# Altium project SMU_V2.03.PrjPcb
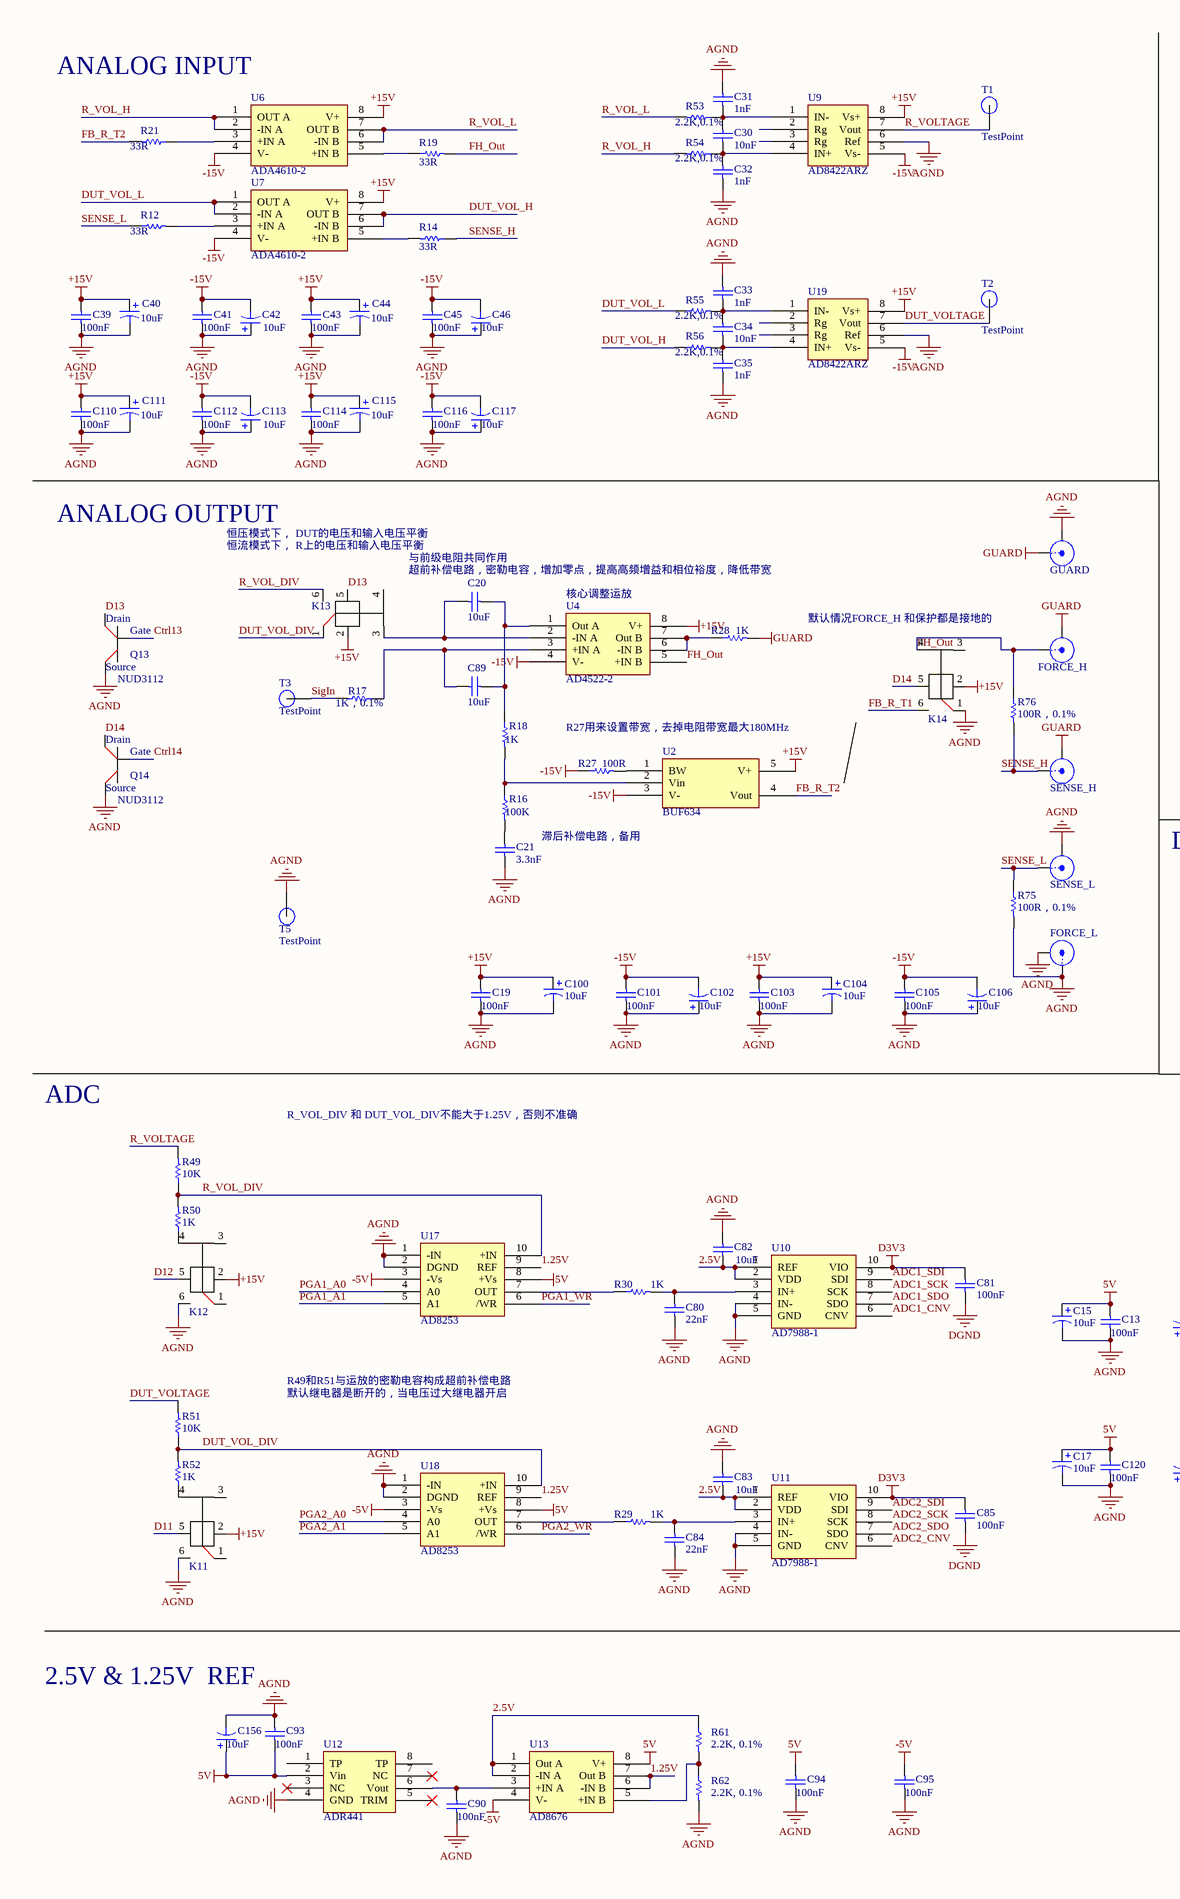
[diagram p0: Analog.SchDoc, left]
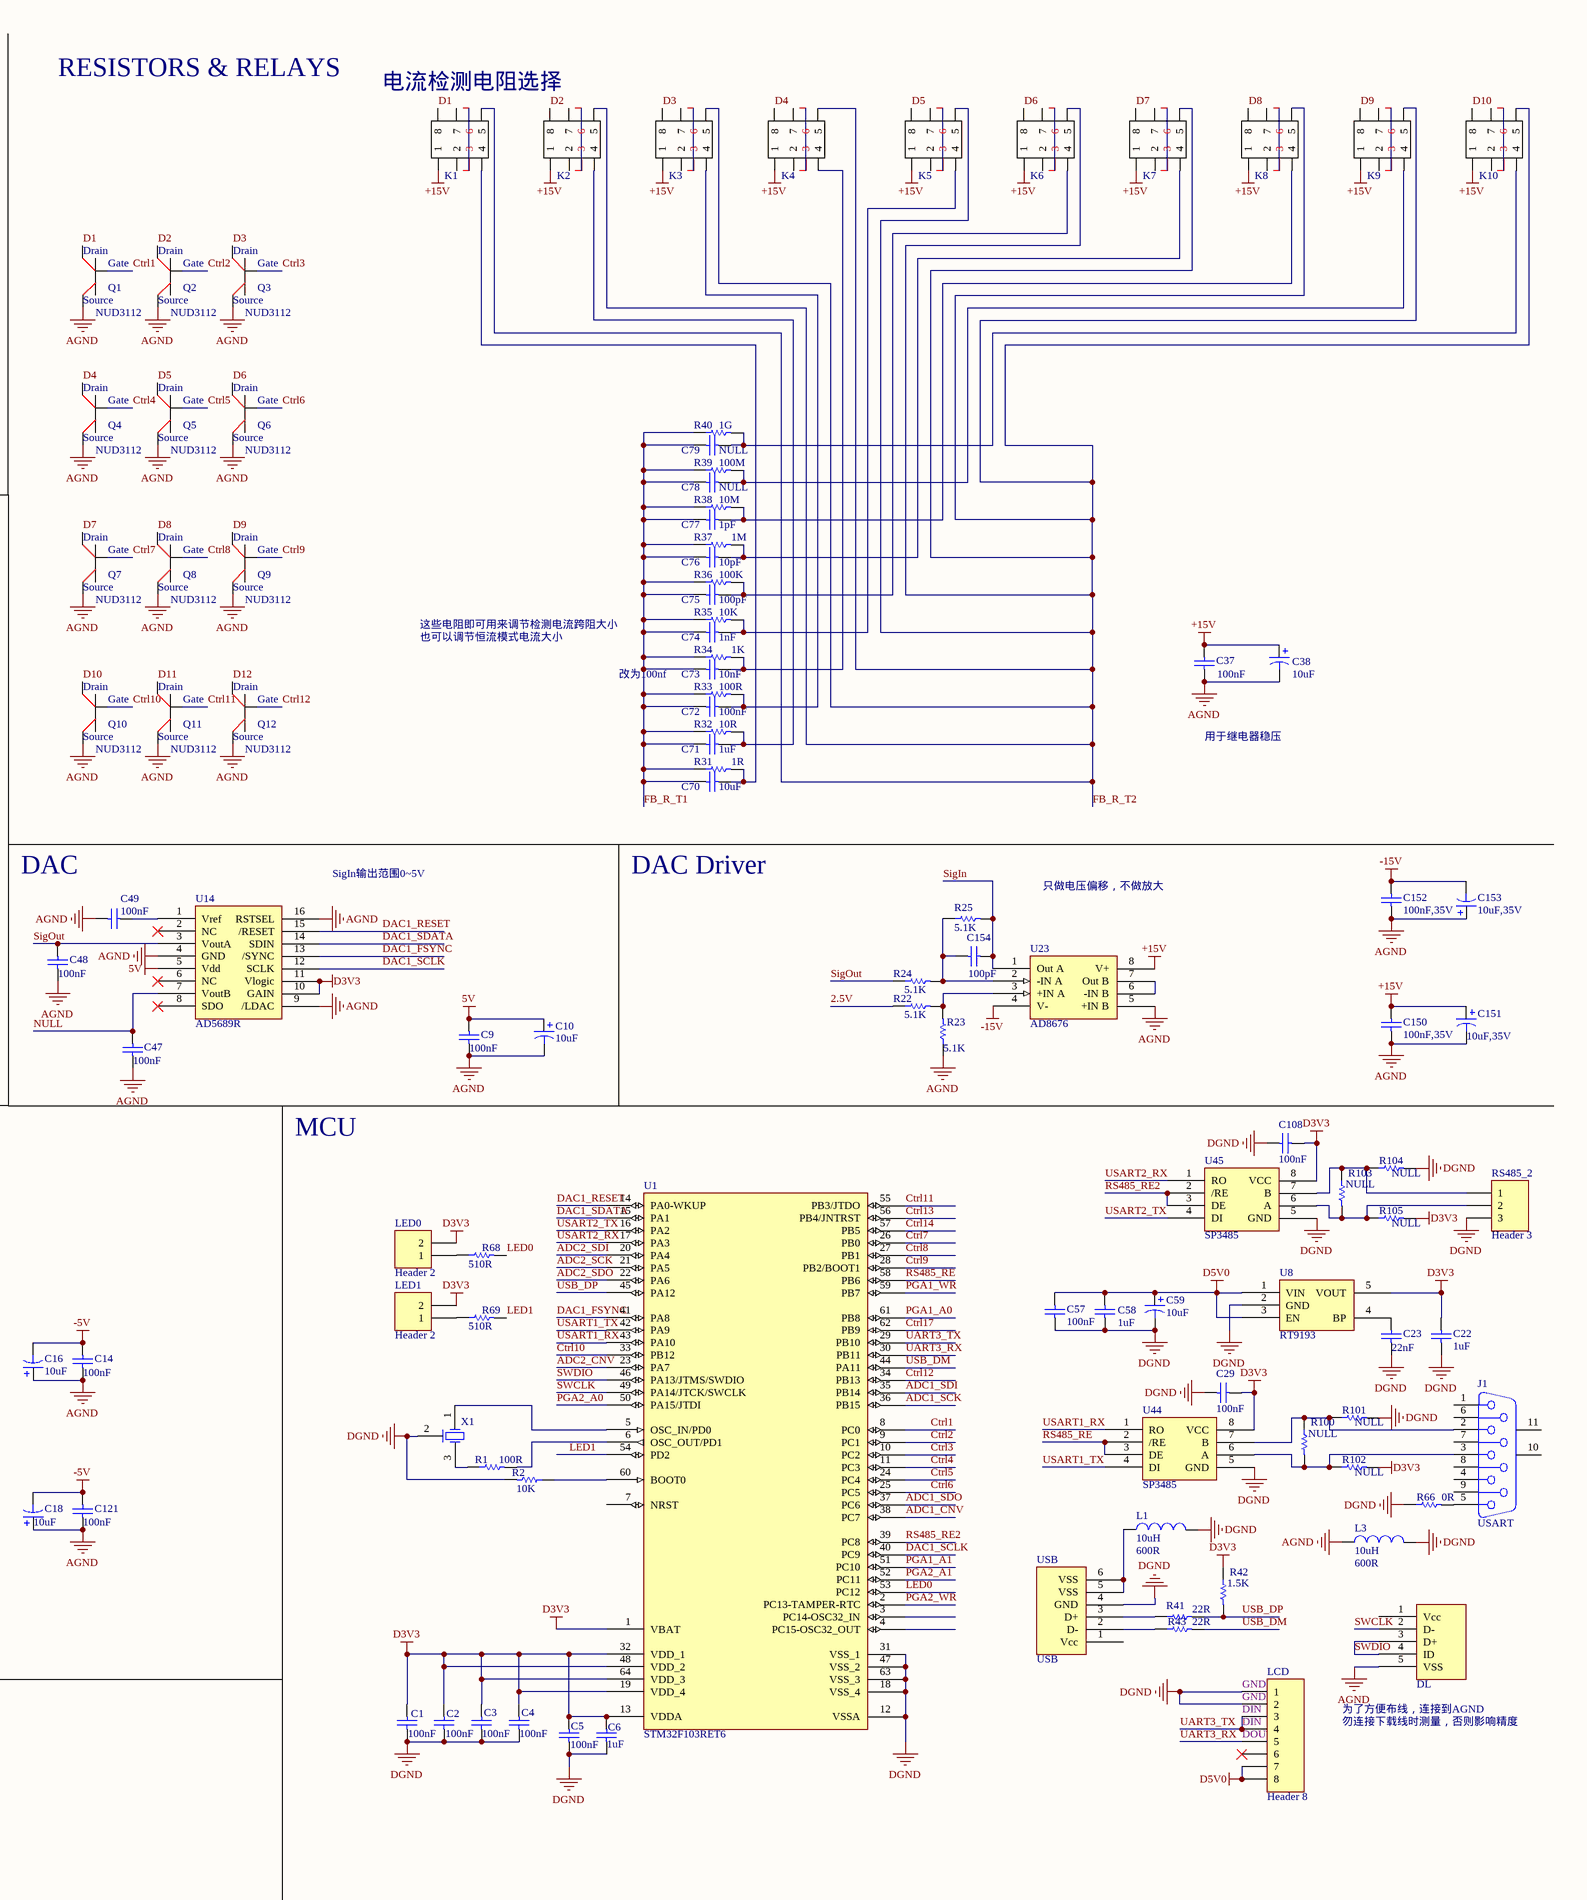
[diagram p1: Analog.SchDoc, right]
1 sheet, 203 parts. Net scope: global (net labels, ports and power ports of the same name join across sheets).
Board file: SMU_V2.03.PcbDoc

## Sheet Analog.SchDoc
size A2

### Parts
C1  100nF  [0603]
C2  100nF  [0603]
C3  100nF  [0603]
C4  100nF  [0603]
C5  100nF  [0603]
C6  1uF  [0603]
C9  100nF  [0603]
C10  10uF  [3216]
C13  100nF  [0603]
C14  100nF  [0603]
C15  10uF  [3216]
C16  10uF  [3216]
C17  10uF  [3216]
C18  10uF  [3216]
C19  100nF  [0603]
C20  10uF  [0805]
C21  3.3nF  [0603]
C22  1uF  [0603]
C23  22nF  [0603]
C29  100nF  [0603]
C30  10nF  [0603]
C31  1nF  [0603]
C32  1nF  [0603]
C33  1nF  [0603]
C34  10nF  [0603]
C35  1nF  [0603]
C37  100nF  [0603]
C38  10uF  [3216]
C39  100nF  [0603]
C40  10uF  [3216]
C41  100nF  [0603]
C42  10uF  [3216]
C43  100nF  [0603]
C44  10uF  [3216]
C45  100nF  [0603]
C46  10uF  [3216]
C47  100nF  [0603]
C48  100nF  [0603]
C49  100nF  [0603]
C57  100nF  [0805]
C58  1uF  [0805]
C59  10uF  [6032_pol]
C70  10uF  [0805]
C71  1uF  [0805]
C72  100nF  [0805]
C73  10nF  [0805]
C74  1nF  [0805]
C75  100pF  [0805]
C76  10pF  [0805]
C77  1pF  [0805]
C78  NULL  [0805]
C79  NULL  [0805]
C80  22nF  [0603]
C81  100nF  [0603]
C82  10uF  [0805]
C83  10uF  [0805]
C84  22nF  [0603]
C85  100nF  [0603]
C89  10uF  [0805]
C90  100nF  [0603]
C93  100nF  [0603]
C94  100nF  [0603]
C95  100nF  [0603]
C100  10uF  [3216]
C101  100nF  [0603]
C102  10uF  [3216]
C103  100nF  [0603]
C104  10uF  [3216]
C105  100nF  [0603]
C106  10uF  [3216]
C108  100nF  [0603]
C110  100nF  [0603]
C111  10uF  [3216]
C112  100nF  [0603]
C113  10uF  [3216]
C114  100nF  [0603]
C115  10uF  [3216]
C116  100nF  [0603]
C117  10uF  [3216]
C120  100nF  [0603]
C121  100nF  [0603]
C150  value 100nF,35V  [0603]  (hidden comment: 100nF)
C151  value 10uF,35V  [3216]  (hidden comment: 10uF)
C152  value 100nF,35V  [0603]  (hidden comment: 100nF)
C153  value 10uF,35V  [3216]  (hidden comment: 10uF)
C154  100pF  [0805]
C156  10uF  [3216]
DL  USB_5pin  [USBmicro_B]  (value not drawn)
FORCE_H  SMB  [SMA]  (value not drawn)
FORCE_L  SMB  [SMA]  (value not drawn)
GUARD  SMB  [SMA]  (value not drawn)
J1  USART  [DSUB1.385-2H9]
K1  AXICOM IM  [AXICOM_IM06]  (value not drawn)
K2  AXICOM IM  [AXICOM_IM06]  (value not drawn)
K3  AXICOM IM  [AXICOM_IM06]  (value not drawn)
K4  AXICOM IM  [AXICOM_IM06]  (value not drawn)
K5  AXICOM IM  [AXICOM_IM06]  (value not drawn)
K6  AXICOM IM  [AXICOM_IM06]  (value not drawn)
K7  AXICOM IM  [AXICOM_IM06]  (value not drawn)
K8  AXICOM IM  [AXICOM_IM06]  (value not drawn)
K9  AXICOM IM  [AXICOM_IM06]  (value not drawn)
K10  AXICOM IM  [AXICOM_IM06]  (value not drawn)
K11  Relay  [Relay_OMRON5V]  (value not drawn)
K12  Relay  [Relay_OMRON5V]  (value not drawn)
K13  Relay  [Relay_OMRON5V]  (value not drawn)
K14  Relay  [Relay_OMRON5V]  (value not drawn)
L1  10uH  value 600R  [0805]
L3  10uH  value 600R  [1206]
LCD  Header 8  [HDR1X8]
LED0  Header 2  [HDR1X2]
LED1  Header 2  [HDR1X2]
Q1  NUD3112  [SOT23]
Q2  NUD3112  [SOT23]
Q3  NUD3112  [SOT23]
Q4  NUD3112  [SOT23]
Q5  NUD3112  [SOT23]
Q6  NUD3112  [SOT23]
Q7  NUD3112  [SOT23]
Q8  NUD3112  [SOT23]
Q9  NUD3112  [SOT23]
Q10  NUD3112  [SOT23]
Q11  NUD3112  [SOT23]
Q12  NUD3112  [SOT23]
Q13  NUD3112  [SOT23]
Q14  NUD3112  [SOT23]
R1  100R  [0603]
R2  10K  [0603]
R12  33R  [0603]
R14  33R  [0603]
R16  100K  [0603]
R17  1K，0.1%  [0603]
R18  1K  [0603]
R19  33R  [0603]
R21  33R  [0603]
R22  5.1K  [0805]
R23  5.1K  [0805]
R24  5.1K  [0805]
R25  5.1K  [0805]
R27  100R  [0603]
R28  1K  [0603]
R29  1K  [0603]
R30  1K  [0603]
R31  1R  [0805]
R32  10R  [0805]
R33  100R  [0805]
R34  1K  [0805]
R35  10K  [0805]
R36  100K  [0805]
R37  1M  [0805]
R38  10M  [0805]
R39  100M  [0805]
R40  1G  [0805]
R41  22R  [0402]
R42  1.5K  [0402]
R43  22R  [0402]
R49  10K  [0603]
R50  1K  [0603]
R51  10K  [0603]
R52  1K  [0603]
R53  2.2K,0.1%  [0603]
R54  2.2K,0.1%  [0603]
R55  2.2K,0.1%  [0603]
R56  2.2K,0.1%  [0603]
R61  2.2K, 0.1%  [0603]
R62  2.2K, 0.1%  [0603]
R66  0R  [0402]
R68  510R  [0603]
R69  510R  [0603]
R75  100R，0.1%  [0603]
R76  100R，0.1%  [0603]
R100  NULL  [0603]
R101  NULL  [0603]
R102  NULL  [0603]
R103  NULL  [0603]
R104  NULL  [0603]
R105  NULL  [0603]
RS485_2  Header 3  [HDR1X3]
SENSE_H  SMB  [SMA]  (value not drawn)
SENSE_L  SMB  [SMA]  (value not drawn)
T1  TestPoint  [TestPoint]
T2  TestPoint  [TestPoint]
T3  TestPoint  [TestPoint]
T5  TestPoint  [TestPoint]
U1  STM32F103RET6  [LQFP64_N]
U2  BUF634  [PSFM-T5]
U4  AD4522-2  [SO-8N]
U6  ADA4610-2  [MSO-8]
U7  ADA4610-2  [MSO-8]
U8  RT9193  [SOT-23-5]
U9  AD8422ARZ  [SO-8N]
U10  AD7988-1  [MSOP10]
U11  AD7988-1  [MSOP10]
U12  ADR441  [SO-8N]
U13  AD8676  [SO-8N]
U14  AD5689R  [TSSOP16]
U17  AD8253  [RM-10]
U18  AD8253  [RM-10]
U19  AD8422ARZ  [SO-8N]
U23  AD8676  [SO-8N]
U44  SP3485  [SO-8N]
U45  SP3485  [SO-8N]
USB  USB  [USB_A]
X1  8M smd  [8Mhz_XTAL]  (value not drawn)

### Nets
5V: C9.2 C10.1 C13.2 C15.1 C17.1 C93.1 C94.2 C120.2 C156.1 U12.2(Vin) U13.8(V+) U14.5(Vdd) U17.8(+Vs) U18.8(+Vs)
+15V: C19.2 C37.2 C38.1 C39.2 C40.1 C43.2 C44.1 C100.1 C103.2 C104.1 C110.2 C111.1 C114.2 C115.1 C150.2 C151.1 K1.1 K2.1 K3.1 K4.1 K5.1 K6.1 K7.1 K8.1 K9.1 K10.1 K11.2 K12.2 K13.2 K14.2 U2.5(V+) U4.8(V+) U6.8(V+) U7.8(V+) U9.8(Vs+) U19.8(Vs+) U23.8(V+)
-5V: C14.2 C16.2 C18.2 C95.2 C121.2 U13.4(V-) U17.3(-Vs) U18.3(-Vs)
-15V: C41.2 C42.2 C45.2 C46.2 C101.2 C102.2 C105.2 C106.2 C112.2 C113.2 C116.2 C117.2 C152.2 C153.2 R27.1 U2.3(V-) U4.4(V-) U6.4(V-) U7.4(V-) U9.5(Vs-) U19.5(Vs-) U23.4(V-)
AGND: C9.1 C10.2 C13.1 C14.1 C15.2 C16.1 C17.2 C18.1 C19.1 C21.2 C31.1 C32.2 C33.1 C35.2 C37.1 C38.2 C39.1 C40.2 C41.1 C42.1 C43.1 C44.2 C45.1 C46.1 C47.2 C48.2 C49.2 C80.2 C82.2 C83.2 C84.1 C90.1 C93.2 C94.1 C95.1 C100.2 C101.1 C102.1 C103.1 C104.2 C105.1 C106.1 C110.1 C111.2 C112.1 C113.1 C114.1 C115.2 C116.1 C117.1 C120.1 C121.1 C150.1 C151.2 C152.1 C153.1 C156.2 DL.5(VSS) FORCE_L.1(X) FORCE_L.2(Y) GUARD.2(Y) K11.6 K12.6 K14.1 L3.1 Q1.2(Source) Q2.2(Source) Q3.2(Source) Q4.2(Source) Q5.2(Source) Q6.2(Source) Q7.2(Source) Q8.2(Source) Q9.2(Source) Q10.2(Source) Q11.2(Source) Q12.2(Source) Q13.2(Source) Q14.2(Source) R23.1 R62.2 R75.2 SENSE_L.2(Y) T5.1 U9.6(Ref) U10.4(IN-) U10.5(GND) U11.4(IN-) U11.5(GND) U12.4(GND) U14.4(GND) U14.9(/LDAC) U14.16(RSTSEL) U17.1(-IN) U17.2(DGND) U18.1(-IN) U18.2(DGND) U19.6(Ref) U23.5(+IN_B)
D3V3: C1.2 C2.2 C3.2 C4.2 C5.2 C6.2 C22.2 C29.2 C81.2 C85.2 C108.2 LED0.2 LED1.2 R42.1 R102.2 R105.2 U1.1(VBAT) U1.13(VDDA) U1.19(VDD_4) U1.32(VDD_1) U1.48(VDD_2) U1.64(VDD_3) U8.5(VOUT) U10.10(VIO) U11.10(VIO) U14.10(GAIN) U14.11(Vlogic) U44.8(VCC) U45.8(VCC)
D5V0: C57.2 C58.2 C59.1 LCD.7 LCD.8 U8.1(VIN) U8.3(EN)
DGND: C1.1 C2.1 C3.1 C4.1 C5.1 C6.1 C22.1 C23.1 C29.1 C57.1 C58.1 C59.2 C81.1 C85.1 C108.1 L1.2 L3.2 LCD.1 LCD.2 R2.2 R66.1 R101.2 R104.2 RS485_2.3 U1.12(VSSA) U1.18(VSS_4) U1.31(VSS_1) U1.47(VSS_2) U1.63(VSS_3) U8.2(GND) U44.5(GND) U45.5(GND) USB.4(GND) X1.2(GND)
GUARD: FORCE_H.2(Y) GUARD.1(X) R28.2 SENSE_H.2(Y)
1.25V: U13.6(-IN_B) U13.7(Out_B) U17.9(REF) U18.9(REF)
2.5V: C82.1 C83.1 R22.1 R61.1 U10.1(REF) U10.2(VDD) U11.1(REF) U11.2(VDD) U13.1(Out_A) U13.2(-IN_A)
ADC1_CNV: U1.38(PC7) U10.6(CNV)
ADC1_SCK: U1.36(PB15) U10.8(SCK)
ADC1_SDI: U1.35(PB14) U10.9(SDI)
ADC1_SDO: U1.37(PC6) U10.7(SDO)
ADC2_CNV: U1.23(PA7) U11.6(CNV)
ADC2_SCK: U1.21(PA5) U11.8(SCK)
ADC2_SDI: U1.20(PA4) U11.9(SDI)
ADC2_SDO: U1.22(PA6) U11.7(SDO)
Ctrl1: Q1.1(Gate) U1.8(PC0)
Ctrl2: Q2.1(Gate) U1.9(PC1)
Ctrl3: Q3.1(Gate) U1.10(PC2)
Ctrl4: Q4.1(Gate) U1.11(PC3)
Ctrl5: Q5.1(Gate) U1.24(PC4)
Ctrl6: Q6.1(Gate) U1.25(PC5)
Ctrl7: Q7.1(Gate) U1.26(PB0)
Ctrl8: Q8.1(Gate) U1.27(PB1)
Ctrl9: Q9.1(Gate) U1.28(PB2/BOOT1)
Ctrl10: Q10.1(Gate) U1.33(PB12)
Ctrl11: Q11.1(Gate) U1.55(PB3/JTDO)
Ctrl12: Q12.1(Gate) U1.34(PB13)
Ctrl13: Q13.1(Gate) U1.56(PB4/JNTRST)
Ctrl14: Q14.1(Gate) U1.57(PB5)
Ctrl17: U1.62(PB9)
D1: K1.8 Q1.3(Drain)
D2: K2.8 Q2.3(Drain)
D3: K3.8 Q3.3(Drain)
D4: K4.8 Q4.3(Drain)
D5: K5.8 Q5.3(Drain)
D6: K6.8 Q6.3(Drain)
D7: K7.8 Q7.3(Drain)
D8: K8.8 Q8.3(Drain)
D9: K9.8 Q9.3(Drain)
D10: K10.8 Q10.3(Drain)
D11: K11.5 Q11.3(Drain)
D12: K12.5 Q12.3(Drain)
D13: K13.5 Q13.3(Drain)
D14: K14.5 Q14.3(Drain)
DAC1_FSYNC: U1.41(PA8) U14.13(/SYNC)
DAC1_RESET: U1.14(PA0-WKUP) U14.15(/RESET)
DAC1_SCLK: U1.40(PC9) U14.12(SCLK)
DAC1_SDATA: U1.15(PA1) U14.14(SDIN)
DUT_VOL_DIV: K13.1 R51.1 R52.2 U18.10(+IN)
DUT_VOL_H: R56.1 U7.6(-IN_B) U7.7(OUT_B)
DUT_VOL_L: R55.1 U7.1(OUT_A) U7.2(-IN_A)
DUT_VOLTAGE: R51.2 T2.1 U19.7(Vout)
FB_R_T1: C70.1 C71.1 C72.1 C73.1 C74.1 C75.1 C76.1 C77.1 C78.1 C79.1 K14.6 R31.1 R32.1 R33.1 R34.1 R35.1 R36.1 R37.1 R38.1 R39.1 R40.1
FB_R_T2: K1.5 K2.5 K3.5 K4.5 K5.5 K6.5 K7.5 K8.5 K9.5 K10.5 R21.2 U2.4(Vout)
FH_Out: FORCE_H.1(X) K14.4 R19.2 R76.1 U4.5(+IN_B)
LED0: R68.2 U1.53(PC12)
LED1: R69.2 U1.54(PD2)
NULL: C47.1 U14.7(VoutB)
PGA1_A0: U1.61(PB8) U17.4(A0)
PGA1_A1: U1.51(PC10) U17.5(A1)
PGA1_WR: U1.59(PB7) U17.6(/WR)
PGA2_A0: U1.50(PA15/JTDI) U18.4(A0)
PGA2_A1: U1.52(PC11) U18.5(A1)
PGA2_WR: U1.2(PC13-TAMPER-RTC) U18.6(/WR)
R_VOL_DIV: K13.6 R49.1 R50.2 U17.10(+IN)
R_VOL_H: R54.2 U6.1(OUT_A) U6.2(-IN_A)
R_VOL_L: R53.2 U6.6(-IN_B) U6.7(OUT_B)
R_VOLTAGE: R49.2 T1.1 U9.7(Vout)
RS485_RE: U1.58(PB6) U44.2(/RE) U44.3(DE)
RS485_RE2: U1.39(PC8) U45.2(/RE) U45.3(DE)
SENSE_H: R14.1 R76.2 SENSE_H.1(X)
SENSE_L: R12.1 R75.1 SENSE_L.1(X)
SigIn: C154.2 R17.2 R25.2 T3.1 U23.1(Out_A)
SigOut: C48.1 R24.1 U14.3(VoutA)
SWCLK: DL.2(D-) U1.49(PA14/JTCK/SWCLK)
SWDIO: DL.3(D+) DL.4(ID) U1.46(PA13/JTMS/SWDIO)
UART3_RX: LCD.5 U1.30(PB11)
UART3_TX: LCD.3 LCD.4 U1.29(PB10)
USART1_RX: U1.43(PA10) U44.1(RO)
USART1_TX: U1.42(PA9) U44.4(DI)
USART2_RX: U1.17(PA3) U45.1(RO)
USART2_TX: U1.16(PA2) U45.4(DI)
USB_DM: R43.2 U1.44(PA11)
USB_DP: R41.2 R42.2 U1.45(PA12)
NetC20_1: C20.1 K13.3 U4.2(-IN_A)
NetC20_2: C20.2 C89.2 R18.1 U4.1(Out_A)
NetC21_1: C21.1 R16.2
NetC23_2: C23.2 U8.4(BP)
NetC30_1: C30.1 C31.2 R53.1 U9.1(IN-)
NetC30_2: C30.2 C32.1 R54.1 U9.4(IN+)
NetC33_2: C33.2 C34.1 R55.2 U19.1(IN-)
NetC34_2: C34.2 C35.1 R56.2 U19.4(IN+)
NetC49_1: C49.1 U14.1(Vref)
NetC70_2: C70.2 K1.4 R31.2
NetC71_2: C71.2 K2.4 R32.2
NetC72_2: C72.2 K3.4 R33.2
NetC73_2: C73.2 K4.4 R34.2
NetC74_2: C74.2 K5.4 R35.2
NetC75_2: C75.2 K6.4 R36.2
NetC76_2: C76.2 K7.4 R37.2
NetC77_2: C77.2 K8.4 R38.2
NetC78_2: C78.2 K9.4 R39.2
NetC79_2: C79.2 K10.4 R40.2
NetC80_1: C80.1 R30.2 U10.3(IN+)
NetC84_2: C84.2 R29.2 U11.3(IN+)
NetC89_1: C89.1 R17.1 U4.3(+IN_A)
NetC90_2: C90.2 U12.6(Vout) U13.3(+IN_A)
NetC154_1: C154.1 R24.2 R25.1 U23.2(-IN_A)
NetJ1_2: J1.2 R100.1 R101.1 U44.7(B)
NetJ1_3: J1.3 R100.2 R102.1 U44.6(A)
NetJ1_5: J1.5 R66.2
NetK1_3: K1.3 K1.6
NetK2_3: K2.3 K2.6
NetK3_3: K3.3 K3.6
NetK4_3: K4.3 K4.6
NetK5_3: K5.3 K5.6
NetK6_3: K6.3 K6.6
NetK7_3: K7.3 K7.6
NetK8_3: K8.3 K8.6
NetK9_3: K9.3 K9.6
NetK10_3: K10.3 K10.6
NetK11_4: K11.4 R52.1
NetK12_4: K12.4 R50.1
NetL1_1: L1.1 USB.5(VSS) USB.6(VSS)
NetLED0_1: LED0.1 R68.1
NetLED1_1: LED1.1 R69.1
NetR1_1: R1.1 X1.3(OSC2)
NetR1_2: R1.2 U1.6(OSC_OUT/PD1)
NetR2_1: R2.1 U1.60(BOOT0)
NetR12_2: R12.2 U7.3(+IN_A)
NetR14_2: R14.2 U7.5(+IN_B)
NetR16_1: R16.1 R18.2 U2.2(Vin)
NetR19_1: R19.1 U6.5(+IN_B)
NetR21_1: R21.1 U6.3(+IN_A)
NetR22_2: R22.2 R23.2 U23.3(+IN_A)
NetR27_2: R27.2 U2.1(BW)
NetR28_1: R28.1 U4.6(-IN_B) U4.7(Out_B)
NetR29_1: R29.1 U18.7(OUT)
NetR30_1: R30.1 U17.7(OUT)
NetR41_1: R41.1 USB.3(D+)
NetR43_1: R43.1 USB.2(D-)
NetR61_2: R61.2 R62.1 U13.5(+IN_B)
NetR103_1: R103.1 R104.1 RS485_2.1 U45.7(B)
NetR103_2: R103.2 R105.1 RS485_2.2 U45.6(A)
NetU1_5: U1.5(OSC_IN/PD0) X1.1(OSC1)
NetU23_6: U23.6(-IN_B) U23.7(Out_B)

Not connected (* = marked no-connect by the designer): DL 1(Vcc); J1 1 4 6 7 8 9 10(MH1) 11(MH2); K1 2 7; K2 2 7; K3 2 7; K4 2 7; K5 2 7; K6 2 7; K7 2 7; K8 2 7; K9 2 7; K10 2 7; K11 1 3; K12 1 3; K13 4; K14 3; LCD 6*; U1 3(PC14-OSC32_IN) 4(PC15-OSC32_OUT) 7(NRST); U9 2(Rg) 3(Rg); U12 1(TP) 3(NC)* 5(TRIM)* 7(NC)* 8(TP); U14 2(NC)* 6(NC)* 8(SDO)*; U19 2(Rg) 3(Rg); USB 1(Vcc)

### Notes on the sheet
- ANALOG INPUT
- RESISTORS & RELAYS
- (near K1) 电流检测电阻选择
- ANALOG OUTPUT
- 恒压模式下， DUT的电压和输入电压平衡
- 恒流模式下， R上的电压和输入电压平衡
- 超前补偿电路，密勒电容，增加零点，提高高频增益和相位裕度，降低带宽
- 与前级电阻共同作用
- (near U4) 核心调整运放
- (near K14) 默认情况FORCE_H 和保护都是接地的
- 这些电阻即可用来调节检测电流跨阻大小
- 也可以调节恒流模式电流大小
- 改为100nf
- R27用来设置带宽，去掉电阻带宽最大180MHz
- 用于继电器稳压
- 滞后补偿电路，备用
- DAC
- SigIn输出范围0~5V
- DAC Driver
- 只做电压偏移，不做放大
- ADC
- R_VOL_DIV 和 DUT_VOL_DIV不能大于1.25V，否则不准确
- MCU
- R49和R51与运放的密勒电容构成超前补偿电路
- 默认继电器是断开的，当电压过大继电器开启
- (near LCD) DIN
- (near LCD) GND
- (near DL) 为了方便布线，连接到AGND
- 勿连接下载线时测量，否则影响精度
- 2.5V & 1.25V  REF
- (near LCD) DOUT

### Library data of the parts
C1-C6 C13 C14 C22 C23 C29-C35 C47-C49 C58 C78-C80 C82-C84 C90 C93-C95 C108 C120 C121 C150 C152 C154 = Cap: Capacitor; Published: 8-Jun-2000; LatestRevisionDate: 17-Jul-2002; LatestRevisionNote: Re-released for DXP Platform.; PackageReference: RAD-0.3; Publisher: Altium Limited; PackageDescription: Radial Cap, Thru-Hole; 2 Leads; 0.3 in Pin Spacing
  C1-C5 C13 C14 C29 C47-C49 C90 C93-C95 C108 C120 C121: Value: 100nF
  C6: Value: 1uf
  C22 C58: Value: 1uF
  C23 C80 C84: Value: 22nF
  C30 C34: Value: 10nF
  C31-C33 C35: Value: 1nF
  C78 C79: Value: NULL
  C82 C83: Value: 10uF
  C154: Value: 100pF
C9 C19 C37 C39 C41 C43 C45 C72 C101 C103 C105 C110 C112 C114 C116 = Cap: Capacitor; Value: 100nF,35V; Published: 8-Jun-2000; LatestRevisionDate: 17-Jul-2002; LatestRevisionNote: Re-released for DXP Platform.; PackageReference: RAD-0.3; Publisher: Altium Limited; PackageDescription: Radial Cap, Thru-Hole; 2 Leads; 0.3 in Pin Spacing
C10 C15-C18 C38 C40 C42 C44 C46 C100 C102 C104 C106 C111 C113 C115 C117 C156 = Cap Pol1: Polarized Capacitor (Radial); Value: 10uF,35V; Published: 8-Jun-2000; LatestRevisionDate: 17-Jul-2002; LatestRevisionNote: Re-released for DXP Platform.; PackageReference: RB7.6-15; Publisher: Altium Limited; PackageDescription: Polarized Capacitor (Radial); 2 Leads
C20 C21 C89 = Cap: Capacitor; Value: 3.3nF,35V; Published: 8-Jun-2000; LatestRevisionDate: 17-Jul-2002; LatestRevisionNote: Re-released for DXP Platform.; PackageReference: RAD-0.3; Publisher: Altium Limited; PackageDescription: Radial Cap, Thru-Hole; 2 Leads; 0.3 in Pin Spacing
C57 C81 C85 = Cap: Capacitor,100V; Published: 8-Jun-2000; LatestRevisionDate: 17-Jul-2002; LatestRevisionNote: Re-released for DXP Platform.; PackageReference: RAD-0.3; Publisher: Altium Limited; PackageDescription: Radial Cap, Thru-Hole; 2 Leads; 0.3 in Pin Spacing; Value: 100nF
C59 C151 C153 = Cap Pol1: Polarized Capacitor (Radial); Published: 8-Jun-2000; LatestRevisionDate: 17-Jul-2002; LatestRevisionNote: Re-released for DXP Platform.; PackageReference: RB7.6-15; Publisher: Altium Limited; PackageDescription: Polarized Capacitor (Radial); 2 Leads
  C59: Value: 10uF
C70 = Cap: Capacitor; Value: 10uF,35V; Published: 8-Jun-2000; LatestRevisionDate: 17-Jul-2002; LatestRevisionNote: Re-released for DXP Platform.; PackageReference: RAD-0.3; Publisher: Altium Limited; PackageDescription: Radial Cap, Thru-Hole; 2 Leads; 0.3 in Pin Spacing
C71 = Cap: Capacitor; Value: 1uF,35V; Published: 8-Jun-2000; LatestRevisionDate: 17-Jul-2002; LatestRevisionNote: Re-released for DXP Platform.; PackageReference: RAD-0.3; Publisher: Altium Limited; PackageDescription: Radial Cap, Thru-Hole; 2 Leads; 0.3 in Pin Spacing
C73 = Cap: Capacitor; Value: 10nF,35V; Published: 8-Jun-2000; LatestRevisionDate: 17-Jul-2002; LatestRevisionNote: Re-released for DXP Platform.; PackageReference: RAD-0.3; Publisher: Altium Limited; PackageDescription: Radial Cap, Thru-Hole; 2 Leads; 0.3 in Pin Spacing
C74 = Cap: Capacitor; Value: 1nF,35V; Published: 8-Jun-2000; LatestRevisionDate: 17-Jul-2002; LatestRevisionNote: Re-released for DXP Platform.; PackageReference: RAD-0.3; Publisher: Altium Limited; PackageDescription: Radial Cap, Thru-Hole; 2 Leads; 0.3 in Pin Spacing
C75 = Cap: Capacitor; Value: 100pF,35V; Published: 8-Jun-2000; LatestRevisionDate: 17-Jul-2002; LatestRevisionNote: Re-released for DXP Platform.; PackageReference: RAD-0.3; Publisher: Altium Limited; PackageDescription: Radial Cap, Thru-Hole; 2 Leads; 0.3 in Pin Spacing
C76 = Cap: Capacitor; Value: 10pF,35V; Published: 8-Jun-2000; LatestRevisionDate: 17-Jul-2002; LatestRevisionNote: Re-released for DXP Platform.; PackageReference: RAD-0.3; Publisher: Altium Limited; PackageDescription: Radial Cap, Thru-Hole; 2 Leads; 0.3 in Pin Spacing
C77 = Cap: Capacitor; Value: 1pF,35V; Published: 8-Jun-2000; LatestRevisionDate: 17-Jul-2002; LatestRevisionNote: Re-released for DXP Platform.; PackageReference: RAD-0.3; Publisher: Altium Limited; PackageDescription: Radial Cap, Thru-Hole; 2 Leads; 0.3 in Pin Spacing
FORCE_H FORCE_L GUARD SENSE_H SENSE_L = SMB: SMB Straight Connector; LatestRevisionDate: 17-Jul-2002; LatestRevisionNote: Re-released for DXP Platform.; Publisher: Altium Limited
J1 = D Connector 9: Receptacle Assembly, 9 Position, Right Angle; PackageDocument: O; Positions: 9; Published: 15-Jun-2001; LatestRevisionDate: 17-Jul-2002; LatestRevisionNote: Re-released for DXP Platform.; DatasheetDocument: 1-Sep-1999; PackageReference: 788750; Publisher: Altium Limited; Orientation: Right Angle; Gender: Receptacle
K1-K10 = AXiCOM IM05
K11-K14 = Relay_OMRON5V: Relay OMRON
L1 L3 = Inductor: Code_IEC: 1005; Published: 8-Jun-2000; LatestRevisionDate: 29-May-2009; LatestRevisionNote: IPC-7351 Footprint Added.; PackageReference: 0402-A; Publisher: Altium Limited; PackageDescription: Chip Inductor; Code_JEITA: 0402
LCD = Header 8: Header, 8-Pin; LatestRevisionDate: 17-Jul-2002; LatestRevisionNote: Re-released for DXP Platform.; Publisher: Altium Limited
LED0 LED1 = Header 2: Header, 2-Pin; LatestRevisionDate: 17-Jul-2002; LatestRevisionNote: Re-released for DXP Platform.; Publisher: Altium Limited
Q1-Q14 = NUD3105: Relay Driver 5V Supply; manufactor: On Semiconductor
R1 R2 R16 R22 R24 R27-R43 R50 R52 R53 R66 R100-R105 = Res1: Resistor; Published: 8-Jun-2000; LatestRevisionDate: 17-Jul-2002; LatestRevisionNote: Re-released for DXP Platform.; PackageReference: AXIAL-0.3; Publisher: Altium Limited
  R1 R27 R33: PackageDescription: Axial Device, Thru-Hole; 2 Leads; 0.3 in Pin Spacing; Value: 100R
  R2: Value: 10K
  R16 R36: PackageDescription: Axial Device, Thru-Hole; 2 Leads; 0.3 in Pin Spacing; Value: 100K
  R22 R24: PackageDescription: Axial Device, Thru-Hole; 2 Leads; 0.3 in Pin Spacing; Value: 5.1K
  R28-R30 R34 R50 R52: PackageDescription: Axial Device, Thru-Hole; 2 Leads; 0.3 in Pin Spacing; Value: 1K
  R31: PackageDescription: Axial Device, Thru-Hole; 2 Leads; 0.3 in Pin Spacing; Value: 1R
  R32: PackageDescription: Axial Device, Thru-Hole; 2 Leads; 0.3 in Pin Spacing; Value: 10R
  R35: PackageDescription: Axial Device, Thru-Hole; 2 Leads; 0.3 in Pin Spacing; Value: 10K
  R37: PackageDescription: Axial Device, Thru-Hole; 2 Leads; 0.3 in Pin Spacing; Value: 1M
  R38: PackageDescription: Axial Device, Thru-Hole; 2 Leads; 0.3 in Pin Spacing; Value: 10M
  R39: PackageDescription: Axial Device, Thru-Hole; 2 Leads; 0.3 in Pin Spacing; Value: 100M
  R40: PackageDescription: Axial Device, Thru-Hole; 2 Leads; 0.3 in Pin Spacing; Value: 1G
  R53: PackageDescription: Axial Device, Thru-Hole; 2 Leads; 0.3 in Pin Spacing; Value: 2.2K
R12 R14 R19 R21 = Res1: Resistor; Value: 2.2K; Published: 8-Jun-2000; LatestRevisionDate: 17-Jul-2002; LatestRevisionNote: Re-released for DXP Platform.; PackageReference: AXIAL-0.3; Publisher: Altium Limited; PackageDescription: Axial Device, Thru-Hole; 2 Leads; 0.3 in Pin Spacing
R17 R54-R56 R61 R62 R75 R76 = Res1: Resistor; Value: 1K; Published: 8-Jun-2000; LatestRevisionDate: 17-Jul-2002; LatestRevisionNote: Re-released for DXP Platform.; PackageReference: AXIAL-0.3; Publisher: Altium Limited; PackageDescription: Axial Device, Thru-Hole; 2 Leads; 0.3 in Pin Spacing
R18 = Res1: Resistor; Value: 100K; Published: 8-Jun-2000; LatestRevisionDate: 17-Jul-2002; LatestRevisionNote: Re-released for DXP Platform.; PackageReference: AXIAL-0.3; Publisher: Altium Limited; PackageDescription: Axial Device, Thru-Hole; 2 Leads; 0.3 in Pin Spacing
R23 R25 R68 R69 = Res1: Resistor; Value: 51K; Published: 8-Jun-2000; LatestRevisionDate: 17-Jul-2002; LatestRevisionNote: Re-released for DXP Platform.; PackageReference: AXIAL-0.3; Publisher: Altium Limited; PackageDescription: Axial Device, Thru-Hole; 2 Leads; 0.3 in Pin Spacing
R49 R51 = Res1: Resistor; Value: 11K; Published: 8-Jun-2000; LatestRevisionDate: 17-Jul-2002; LatestRevisionNote: Re-released for DXP Platform.; PackageReference: AXIAL-0.3; Publisher: Altium Limited; PackageDescription: Axial Device, Thru-Hole; 2 Leads; 0.3 in Pin Spacing
RS485_2 = Header 3: Header, 3-Pin; LatestRevisionDate: 17-Jul-2002; LatestRevisionNote: Re-released for DXP Platform.; Publisher: Altium Limited
U1 = STM32F103RBT6: STM32 ARM-based 32-bit MCU with 128 Kbytes Flash, 64-pin LQFP, Industrial Temperature; Published: 30-May-2008; DatasheetVersion: rev6, Mar-2008; PackageVersion: Mar-2008; PackageReference: LQFP64; Publisher: Altium Limited; PackageDescription: 64-Pin Low-Profile Quad Flat Pack, 10 x 10 mm Body, 0.5 mm Pitch (LQFP64); ComponentLink1Description: Manufacturer Link; ComponentLink1URL: www.st.com/stm32; ComponentLink2Description: Datasheet; ComponentLink2URL: http://www.st.com/stonline/products/literature/ds/13587.pdf
U2 = BUF634: Manufacture: TI
U4 = AD8676
U9 U19 = AD8422
U12 = ADR441: Ultralow Noise, XFET Voltage References
U14 = AD5687R: manufacture: ADI, inc
U17 U18 = AD8253: Manufacture: ADI
USB = USB_Normal: USB interface